# EAGLE schematic ledpower (EAGLE 6.5.0)
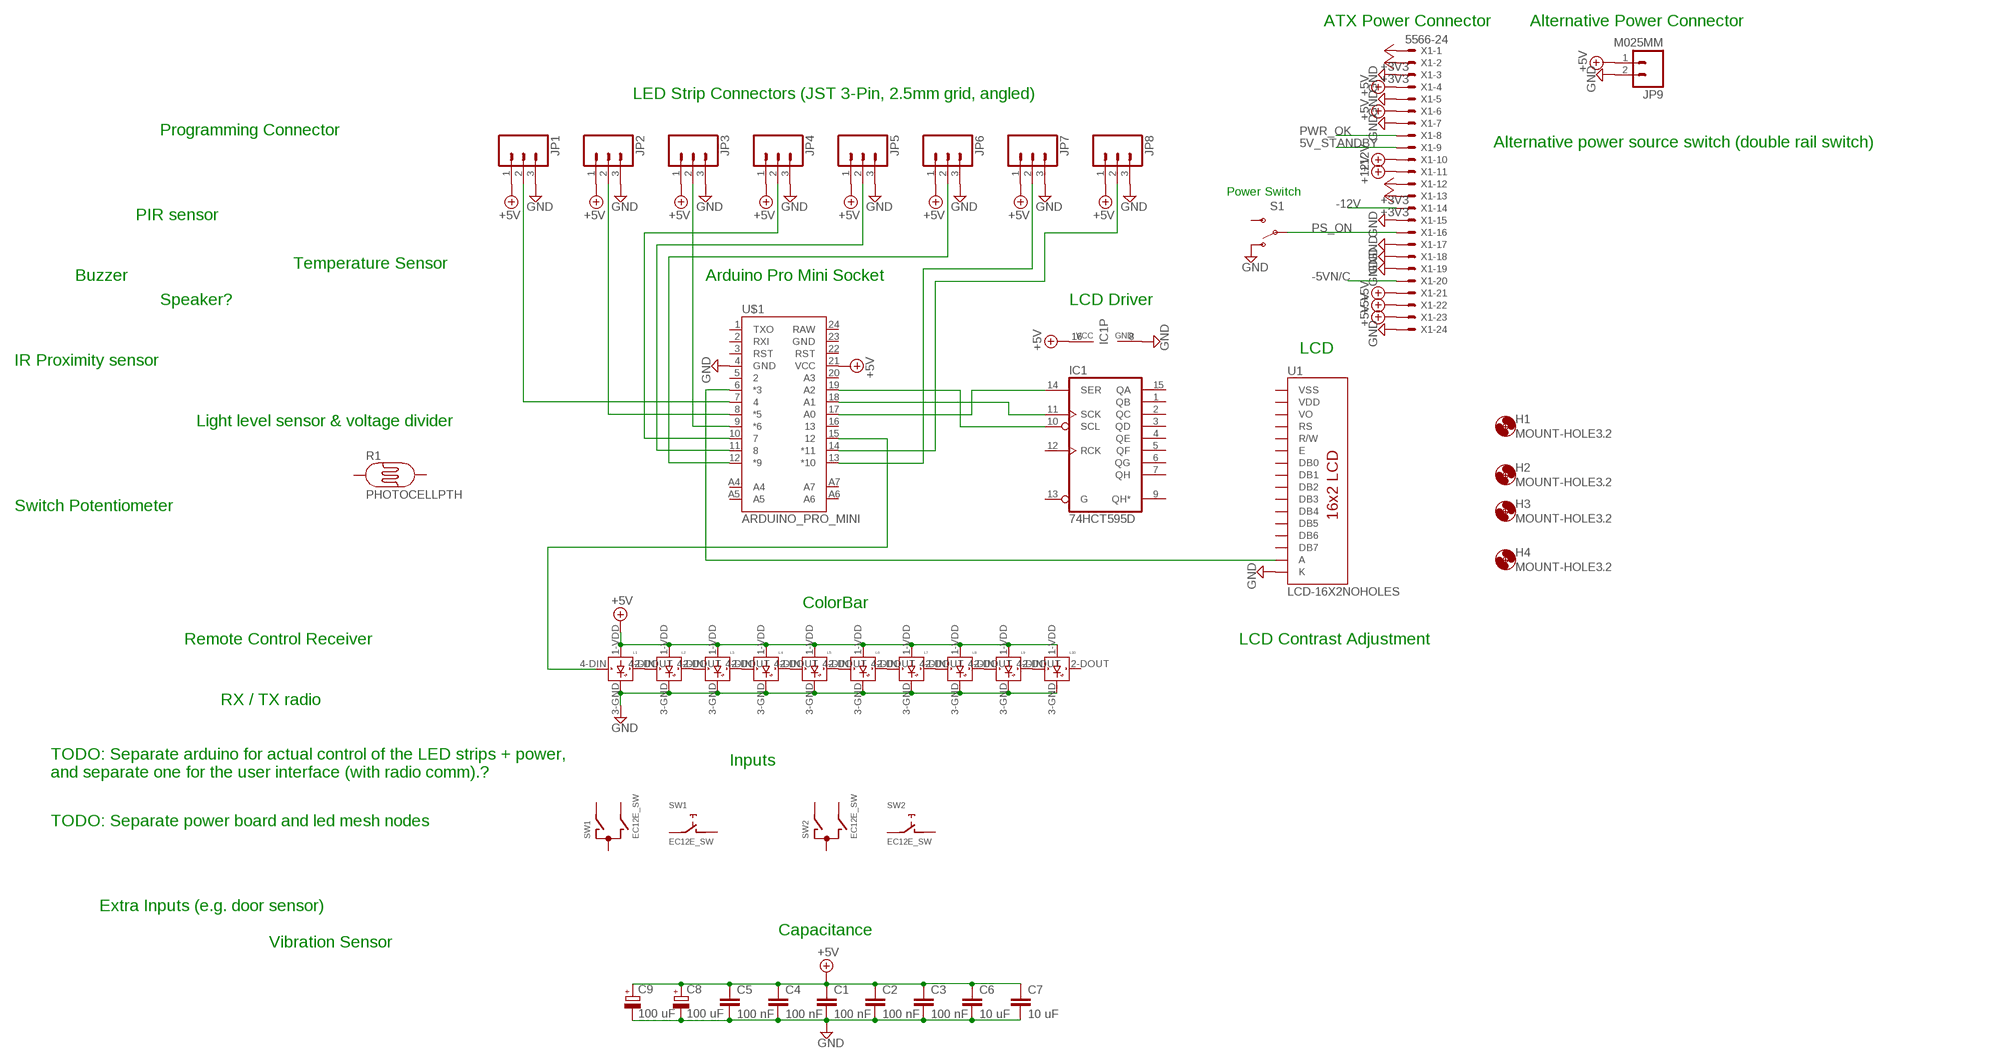
[diagram p0: schematic, sheet 1]

## Parts
C1  100 nF  C-EUC0805  [C0805]
C2  100 nF  C-EUC0805  [C0805]
C3  100 nF  C-EUC0805  [C0805]
C4  100 nF  C-EUC0805  [C0805]
C5  100 nF  C-EUC0805  [C0805]
C6  10 uF  C-EUC1206  [C1206]
C7  10 uF  C-EUC1206  [C1206]
C8  100 uF  CPOL-EUE3.5-10  [E3,5-10]
C9  100 uF  CPOL-EUE3.5-10  [E3,5-10]
H1  MOUNT-HOLE3.2  [3,2]
H2  MOUNT-HOLE3.2  [3,2]
H3  MOUNT-HOLE3.2  [3,2]
H4  MOUNT-HOLE3.2  [3,2]
IC1  74HCT595D  [SO16]
JP1  M03LONGPADS  [1X03_LONGPADS]
JP2  M03LONGPADS  [1X03_LONGPADS]
JP3  M03LONGPADS  [1X03_LONGPADS]
JP4  M03LONGPADS  [1X03_LONGPADS]
JP5  M03LONGPADS  [1X03_LONGPADS]
JP6  M03LONGPADS  [1X03_LONGPADS]
JP7  M03LONGPADS  [1X03_LONGPADS]
JP8  M03LONGPADS  [1X03_LONGPADS]
JP9  M025MM  [SCREWTERMINAL-5MM-2]
L1  WS2812B  [WS2812B]
L2  WS2812B  [WS2812B]
L3  WS2812B  [WS2812B]
L4  WS2812B  [WS2812B]
L5  WS2812B  [WS2812B]
L6  WS2812B  [WS2812B]
L7  WS2812B  [WS2812B]
L8  WS2812B  [WS2812B]
L9  WS2812B  [WS2812B]
L10  WS2812B  [WS2812B]
R1  PHOTOCELLPTH  [PHOTOCELL]
S1  SWITCH-SPSTPTH  [SWITCH-SPDT]
SW1  EC12E_SW  [ALPS_EC12E_SW]
SW2  EC12E_SW  [ALPS_EC12E_SW]
U1  LCD-16X2NOHOLES  [LCD-16X2_NOHOLES]
U$1  ARDUINO_PRO_MINI  [ARDUINO_PRO_MINI]
X1  5566-24  [5566-24]

## Nets
5V_STANDBY: X1.9
+3V3: X1.1 X1.2 X1.12 X1.13
+5V: C1.1 C2.1 C3.1 C4.1 C5.1 C6.1 C7.1 C8.+ C9.+ IC1.16(VCC) JP1.1 JP2.1 JP3.1 JP4.1 JP5.1 JP6.1 JP7.1 JP8.1 JP9.1 L1.1-VDD(VDD) L2.1-VDD(VDD) L3.1-VDD(VDD) L4.1-VDD(VDD) L5.1-VDD(VDD) L6.1-VDD(VDD) L7.1-VDD(VDD) L8.1-VDD(VDD) L9.1-VDD(VDD) L10.1-VDD(VDD) U$1.21(VCC) X1.4 X1.6 X1.21 X1.22 X1.23
+12V: X1.10 X1.11
-5VN/C: X1.20
-12V: X1.14
GND: C1.2 C2.2 C3.2 C4.2 C5.2 C6.2 C7.2 C8.- C9.- IC1.8(GND) JP1.3 JP2.3 JP3.3 JP4.3 JP5.3 JP6.3 JP7.3 JP8.3 JP9.2 L1.3-GND(GND) L2.3-GND(GND) L3.3-GND(GND) L4.3-GND(GND) L5.3-GND(GND) L6.3-GND(GND) L7.3-GND(GND) L8.3-GND(GND) L9.3-GND(GND) L10.3-GND(GND) S1.1(O) U1.16(K) U$1.4(GND) X1.3 X1.5 X1.7 X1.15 X1.17 X1.18 X1.19 X1.24
N$1: L1.2-DOUT(DOUT) L2.4-DIN(DIN)
N$2: L2.2-DOUT(DOUT) L3.4-DIN(DIN)
N$3: L3.2-DOUT(DOUT) L4.4-DIN(DIN)
N$4: L4.2-DOUT(DOUT) L5.4-DIN(DIN)
N$5: L5.2-DOUT(DOUT) L6.4-DIN(DIN)
N$6: L6.2-DOUT(DOUT) L7.4-DIN(DIN)
N$7: L7.2-DOUT(DOUT) L8.4-DIN(DIN)
N$8: L8.2-DOUT(DOUT) L9.4-DIN(DIN)
N$9: L9.2-DOUT(DOUT) L10.4-DIN(DIN)
N$10: L1.4-DIN(DIN) U$1.15
N$11: JP1.2 U$1.7
N$12: JP2.2 U$1.8(*5)
N$13: JP3.2 U$1.9(*6)
N$14: JP4.2 U$1.10
N$15: JP5.2 U$1.11
N$16: JP6.2 U$1.12(*9)
N$17: JP7.2 U$1.13(*10)
N$18: JP8.2 U$1.14(*11)
N$19: IC1.14(SER) U$1.17(A0)
N$20: U1.15(A) U$1.6(*3)
N$21: IC1.11(SCK) U$1.18(A1)
N$22: IC1.10(SCL) U$1.19(A2)
PS_ON: S1.2(P) X1.16
PWR_OK: X1.8
Unconnected: IC1.1(QB) IC1.2(QC) IC1.3(QD) IC1.4(QE) IC1.5(QF) IC1.6(QG) IC1.7(QH) IC1.9(QH*) IC1.12(RCK) IC1.13(G) IC1.15(QA) L10.2-DOUT(DOUT) R1.1 R1.2 S1.3(S) SW1.A SW1.B SW1.C SW1.D SW1.E SW1.GND1(G) SW1.GND2(G) SW2.A SW2.B SW2.C SW2.D SW2.E SW2.GND1(G) SW2.GND2(G) U1.3(VO) U1.4(RS) U1.5(R/W) U1.6(E) U1.7(DB0) U1.8(DB1) U1.9(DB2) U1.10(DB3) U1.11(DB4) U1.12(DB5) U1.13(DB6) U1.14(DB7) U$1.1(TXO) U$1.2(RXI) U$1.3(RST) U$1.5 U$1.16 U$1.20(A3) U$1.22(RST) U$1.23(GND) U$1.24(RAW) U$1.A4 U$1.A5 U$1.A6 U$1.A7

## Notes on the sheet
- ATX Power Connector | Alternative Power Connector
- LED Strip Connectors (JST 3-Pin, 2.5mm grid, angled)
- Programming Connector
- Alternative power source switch (double rail switch)
- Power Switch
- PIR sensor
- Temperature Sensor
- Buzzer | Arduino Pro Mini Socket
- Speaker? | LCD Driver
- LCD
- IR Proximity sensor
- Light level sensor & voltage divider
- Switch Potentiometer
- ColorBar
- Remote Control Receiver | LCD Contrast Adjustment
- RX / TX radio
- Inputs
- TODO: Separate arduino for actual control of the LED strips + power, 
  and separate one for the user interface (with radio comm).?
- TODO: Separate power board and led mesh nodes
- Extra Inputs (e.g. door sensor)
- Capacitance
- Vibration Sensor

## Power pins joined to a net without a drawn wire
VDD: U1.2(VDD)
VSS: U1.1(VSS)

## Library data of the parts
C1-C7 = rcl:C-EU: CAPACITOR, European symbol
C8 C9 = rcl:CPOL-EU: POLARIZED CAPACITOR, European symbol
H1-H4 = holes:MOUNT-HOLE: MOUNTING HOLE with drill center marker
IC1 = 74xx-eu:74*595: 8-bit SHIFT REGISTER, output latch
JP1-JP8 = SparkFun-Connectors:M03: Header 3 Standard 3-pin 0.1" header. Use with straight break away headers (SKU : PRT-00116), right angle break away headers (PRT-00553), swiss pins (PRT-00743), machine pins (PRT-00117), and female headers (PRT-00115). Molex polarized connector foot print use with SKU : PRT-08232 with associated crimp pins and housings.
JP9 = SparkFun-Connectors:M02: Standard 2-pin 0.1" header. Use with - straight break away headers ( PRT-00116) - right angle break away headers (PRT-00553) - swiss pins (PRT-00743) - machine pins (PRT-00117) - female headers (PRT-00115) Molex polarized connector foot print use with: PRT-08233 with associated crimp pins and housings. 2.54_SCREWTERM for use with PRT-10571. 3.5mm Screw Terminal footprints for PRT-08084 5mm Screw Terminal footprints for use with PRT-08433
L1-L10 = adafruit:WS2812B
R1 = SparkFun:PHOTOCELL: Photocell Also known as a CdS photoresistor. This is a low cost way to detect light levels. Resistance decreases with more incoming light. SparkFun SKU: SEN-09088
S1 = SparkFun:SWITCH-SPST: SPST Switch Simple slide switch. Spark Fun Electronics SKU : COM-00102
SW1 SW2 = switch-alps:EC12E_SW: ALPS rotary Encoder EC12E series with switch; MPN: EC12E2424407; OC_FARNELL: 1520813; OC_NEWARK: 74M1068
U1 = SparkFun:LCD-16X2
U$1 = SparkFun-Boards:ARDUINO_PRO_MINI
X1 = con-molex:5566-24: Mini FIT connector 24 pol Source: http://www.molex.com; OC_FARNELL: unknown; OC_NEWARK: unknown